# Altium schematic sheet [1] PowerStage12To5.SchDoc
size A4
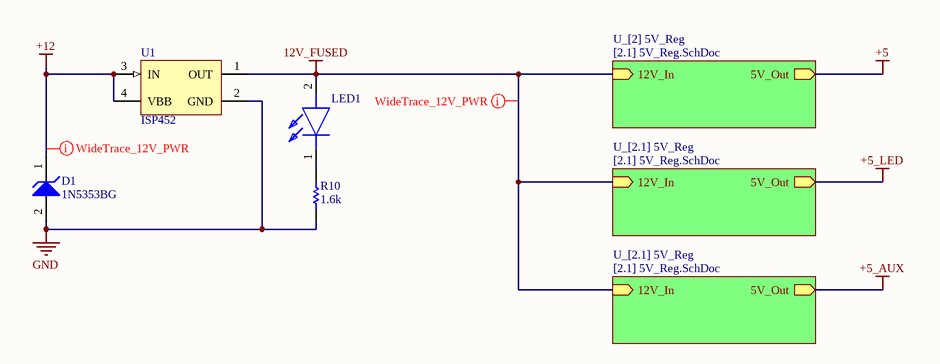
[diagram p0: [1] PowerStage12To5.SchDoc]

## Parts
D1  1N5353BG  [ONSC-SURMETIC40-2-017AA-01]
LED1  150060GS75000  [LEDC1608X80N]  (value not drawn)
R10  1.6k  [RESC0603(1608)_L]
U1  ISP452  [INF-SOT223_L]

## Sub-sheets
U_[2.1] 5V_Reg = [2.1] 5V_Reg.SchDoc: 12V_In (in), 5V_Out (out)
U_[2.1] 5V_Reg = [2.1] 5V_Reg.SchDoc: 12V_In (in), 5V_Out (out)
U_[2] 5V_Reg = [2.1] 5V_Reg.SchDoc: 12V_In (in), 5V_Out (out)

## Nets
12V_FUSED: LED1.2(A) U1.1(OUT) ; sheet U_[2] 5V_Reg/12V_In, sheet U_[2.1] 5V_Reg/12V_In, sheet U_[2.1] 5V_Reg/12V_In
+5: sheet U_[2] 5V_Reg/5V_Out
+5_AUX: sheet U_[2.1] 5V_Reg/5V_Out
+5_LED: sheet U_[2.1] 5V_Reg/5V_Out
+12: D1.1(K) U1.3(IN) U1.4(VBB)
GND: D1.2(A) R10.1 U1.2(GND)
NetLED1_1: LED1.1(K) R10.2

## Layout directives
rule Width Constraint [Pref Width = 78.74mil    Min Width = 78.74mil    Max Width = 78.74mil]: +12
rule Width Constraint [Pref Width = 150mil    Min Width = 150mil    Max Width = 150mil]: 12V_FUSED

## Library data of the parts
D1 = CMP-1060-01290-1: 5 W Zener Voltage Regulator, 2-Pin Surmetic(TM) 40, Pb-Free, Bulk Box; Manufacturer: On Semiconductor; P Max (W): 5; VZ Typ (V): 16; Packing: Bulk Box; RoHS: Pb-Free; DatasheetVersion: Rev. 14; PackageDescription: 2-Pin, Axial Lead, Diameter 3.49 mm; ComponentLink3Description: Package Specification; PackageVersion: Rev. O, 09/2005; Mounting Technology: Through Hole; ComponentLink2Description: Datasheet; PartNumber: 1N5353BG; PackageReference: SURMETIC40-2-017AA-01; ComponentLink2URL: http://www.onsemi.cn/pub_link/Collateral/1N5333B-D.PDF; ComponentLink3URL: http://www.onsemi.cn/pub_link/Collateral/017AA.PDF; ComponentLink1Description: Manufacturer URL; ComponentLink1URL: http://www.onsemi.com/
LED1 = 150060GS75000: LED; Manufacturer_Name: Wurth Elektronik; Datasheet Link: https://componentsearchengine.com/Datasheets/2/150060GS75000.pdf; Height: 0.8mm; Manufacturer_Part_Number: 150060GS75000; Mouser Part Number: 710-150060GS75000; Mouser Price/Stock: https://www.mouser.co.uk/ProductDetail/Wurth-Elektronik/150060GS75000?qs=LlUlMxKIyB0UYkq5lDO8nA%3D%3D
R10 = CMP-1012-00222-1: 2R94 0.1W 1% 0603 (1608 Metric)  SMD; Case-Metric: 1608; Case-EIA: 0603; Value: 2.94 Ohm; Power: 0.1 W; Technology: SMT; Tolerance: 1 %
U1 = CMP-1095-00141-1: Smart Power High-Side-Switch for Industrial Applications, 5 to 34 V Operating, -30 to 85 degC, SOT223, Reel, Green; Manufacturer: Infineon; Green: TRUE; IL (nom)min - all channels active: 0.7Â A; Channels: 1; IL (nom)min - one channel active: 0.8Â A; Operating Voltage Range (min): 5 V; Ptot (max): 1.8Â W; toff (max): 150 us; RON (max) @ Tj max: 400 mOhm; ton (max): 100 us; IL (SCp): 1.5Â A; Operating Voltage Range (max): 34 V; RON @ 25 degC: 200 mOhm (max); ComponentLink3Description: Package Specification; Mounting Technology: Surface Mount; ComponentLink2Description: Datasheet; PartNumber: ISP452; Packing: Reel; Load Current (typ): 0.7Â A; PackageDescription: 4-Pin Small Outline Transistor Package, 6.5 x 3.5 mm Body, 2.3 mm Pitch; ComponentLink3URL: http://www.infineon.com/dgdl/SOT223-Package_Overview.pdf?folderId=db3a30431936bc4b0119530470b03c3d&fileId=db3a30431936bc4b0119531d40b93c5c; ComponentLink1Description: Manufacturer URL; ComponentLink1URL: http://www.infineon.com/; ComponentLink2URL: http://www.infineon.com/dgdl/ISP452_20060301.pdf?folderId=db3a304412b407950112b408e8c90004&fileId=db3a304412b407950112b42957ef40c3; PackageReference: SOT223; IL (SC): 1.5Â A; PackageVersion: Apr-08